# Altium schematic sheet Power1.SchDoc
size A3
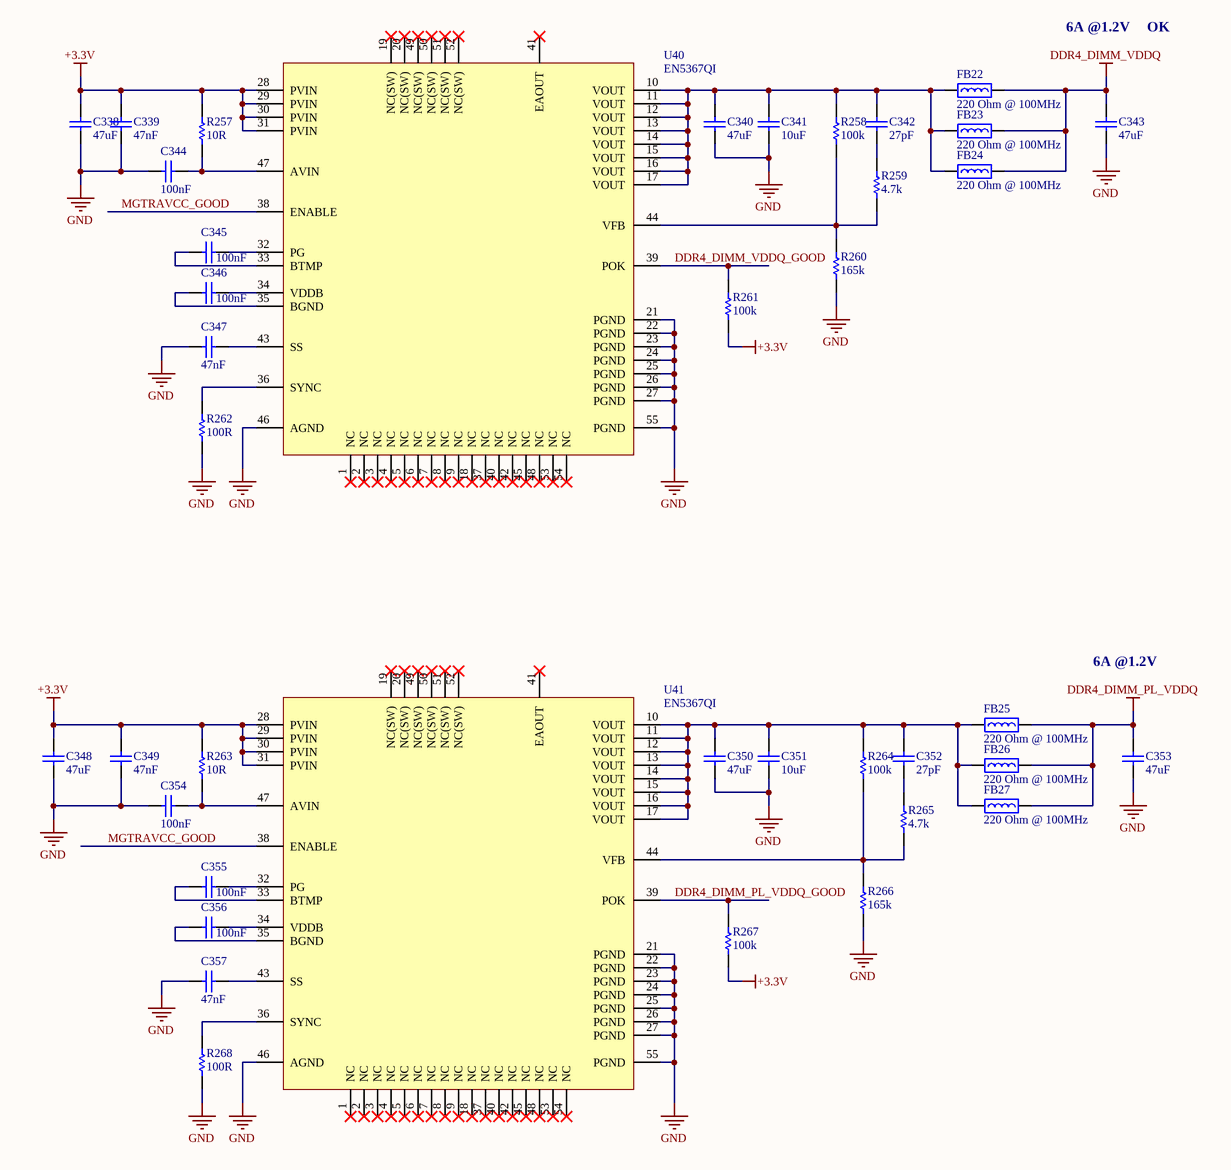
[diagram p0: Power1.SchDoc]

## Parts
C338  47uF  [CAPC3216L_1206]
C339  47nF  [CAPC2012L_0805]
C340  47uF  [CAPC3216L_1206]
C341  10uF  [CAPC1005L_0402]
C342  27pF  [CAPC1005L_0402]
C343  47uF  [CAPC3216L_1206]
C344  100nF  [CAPC1005L_0402]
C345  100nF  [CAPC1005L_0402]
C346  100nF  [CAPC1005L_0402]
C347  47nF  [CAPC2012L_0805]
C348  47uF  [CAPC3216L_1206]
C349  47nF  [CAPC2012L_0805]
C350  47uF  [CAPC3216L_1206]
C351  10uF  [CAPC1005L_0402]
C352  27pF  [CAPC1005L_0402]
C353  47uF  [CAPC3216L_1206]
C354  100nF  [CAPC1005L_0402]
C355  100nF  [CAPC1005L_0402]
C356  100nF  [CAPC1005L_0402]
C357  47nF  [CAPC2012L_0805]
FB22  Impedance @ Frequency: 220 Ohm @ 100MHz  [INDC1608N_0603]  (hidden comment: BEAD0603_220_2A5_40M)
FB23  Impedance @ Frequency: 220 Ohm @ 100MHz  [INDC1608N_0603]  (hidden comment: BEAD0603_220_2A5_40M)
FB24  Impedance @ Frequency: 220 Ohm @ 100MHz  [INDC1608N_0603]  (hidden comment: BEAD0603_220_2A5_40M)
FB25  Impedance @ Frequency: 220 Ohm @ 100MHz  [INDC1608N_0603]  (hidden comment: BEAD0603_220_2A5_40M)
FB26  Impedance @ Frequency: 220 Ohm @ 100MHz  [INDC1608N_0603]  (hidden comment: BEAD0603_220_2A5_40M)
FB27  Impedance @ Frequency: 220 Ohm @ 100MHz  [INDC1608N_0603]  (hidden comment: BEAD0603_220_2A5_40M)
R257  value 10R  [RESC1005L_0402]  (hidden comment: RES0402_10R_0W1_1T)
R258  value 100k  [RESC1005L_0402]  (hidden comment: RES0402_100K_0W2_1T)
R259  value 4.7k  [RESC1005L_0402]  (hidden comment: RES0402_4K7_0W1_1T)
R260  value 165k  [RESC1005L_0402]  (hidden comment: RES0402_165K_0W1_1T)
R261  value 100k  [RESC1005L_0402]  (hidden comment: RES0402_100K_0W2_1T)
R262  value 100R  [RESC1005L_0402]  (hidden comment: RES0402_100R_0W1_1T)
R263  value 10R  [RESC1005L_0402]  (hidden comment: RES0402_10R_0W1_1T)
R264  value 100k  [RESC1005L_0402]  (hidden comment: RES0402_100K_0W2_1T)
R265  value 4.7k  [RESC1005L_0402]  (hidden comment: RES0402_4K7_0W1_1T)
R266  value 165k  [RESC1005L_0402]  (hidden comment: RES0402_165K_0W1_1T)
R267  value 100k  [RESC1005L_0402]  (hidden comment: RES0402_100K_0W2_1T)
R268  value 100R  [RESC1005L_0402]  (hidden comment: RES0402_100R_0W1_1T)
U40  EN5367QI  [QFN54-EN5367QI]
U41  EN5367QI  [QFN54-EN5367QI]

## Nets
+3.3V: C338.2 C339.2 C348.2 C349.2 R257.2 R261.2 R263.2 R267.2 U40.28(PVIN) U40.29(PVIN) U40.30(PVIN) U40.31(PVIN) U41.28(PVIN) U41.29(PVIN) U41.30(PVIN) U41.31(PVIN)
DDR4_DIMM_PL_VDDQ: C353.2 FB25.2 FB26.2 FB27.2
DDR4_DIMM_VDDQ: C343.2 FB22.2 FB23.2 FB24.2
GND: C338.1 C339.1 C340.1 C341.1 C343.1 C344.2 C347.2 C348.1 C349.1 C350.1 C351.1 C353.1 C354.2 C357.2 R260.1 R262.2 R266.1 R268.2 U40.21(PGND) U40.22(PGND) U40.23(PGND) U40.24(PGND) U40.25(PGND) U40.26(PGND) U40.27(PGND) U40.46(AGND) U40.55(PGND) U41.21(PGND) U41.22(PGND) U41.23(PGND) U41.24(PGND) U41.25(PGND) U41.26(PGND) U41.27(PGND) U41.46(AGND) U41.55(PGND)
DDR4_DIMM_PL_VDDQ_GOOD: R267.1 U41.39(POK)
DDR4_DIMM_VDDQ_GOOD: R261.1 U40.39(POK)
MGTRAVCC_GOOD: U40.38(ENABLE) U41.38(ENABLE)
NetC340_2: C340.2 C341.2 C342.2 FB22.1 FB23.1 FB24.1 R258.2 U40.10(VOUT) U40.11(VOUT) U40.12(VOUT) U40.13(VOUT) U40.14(VOUT) U40.15(VOUT) U40.16(VOUT) U40.17(VOUT)
NetC342_1: C342.1 R259.2
NetC344_1: C344.1 R257.1 U40.47(AVIN)
NetC345_1: C345.1 U40.32(PG)
NetC345_2: C345.2 U40.33(BTMP)
NetC346_1: C346.1 U40.34(VDDB)
NetC346_2: C346.2 U40.35(BGND)
NetC347_1: C347.1 U40.43(SS)
NetC350_2: C350.2 C351.2 C352.2 FB25.1 FB26.1 FB27.1 R264.2 U41.10(VOUT) U41.11(VOUT) U41.12(VOUT) U41.13(VOUT) U41.14(VOUT) U41.15(VOUT) U41.16(VOUT) U41.17(VOUT)
NetC352_1: C352.1 R265.2
NetC354_1: C354.1 R263.1 U41.47(AVIN)
NetC355_1: C355.1 U41.32(PG)
NetC355_2: C355.2 U41.33(BTMP)
NetC356_1: C356.1 U41.34(VDDB)
NetC356_2: C356.2 U41.35(BGND)
NetC357_1: C357.1 U41.43(SS)
NetR258_1: R258.1 R259.1 R260.2 U40.44(VFB)
NetR262_1: R262.1 U40.36(SYNC)
NetR264_1: R264.1 R265.1 R266.2 U41.44(VFB)
NetR268_1: R268.1 U41.36(SYNC)

Not connected (* = marked no-connect by the designer): U40 1(NC)* 2(NC)* 3(NC)* 4(NC)* 5(NC)* 6(NC)* 7(NC)* 8(NC)* 9(NC)* 18(NC)* 19(NC(SW))* 20(NC(SW))* 37(NC)* 40(NC)* 41(EAOUT)* 42(NC)* 45(NC)* 48(NC)* 49(NC(SW))* 50(NC(SW))* 51(NC(SW))* 52(NC(SW))* 53(NC)* 54(NC)*; U41 1(NC)* 2(NC)* 3(NC)* 4(NC)* 5(NC)* 6(NC)* 7(NC)* 8(NC)* 9(NC)* 18(NC)* 19(NC(SW))* 20(NC(SW))* 37(NC)* 40(NC)* 41(EAOUT)* 42(NC)* 45(NC)* 48(NC)* 49(NC(SW))* 50(NC(SW))* 51(NC(SW))* 52(NC(SW))* 53(NC)* 54(NC)*

## Notes on the sheet
- 6A @1.2V
- OK

## Library data of the parts
C338 C340 C343 C348 C350 C353 = CAPCER1206X5R47U25V_20T: CAP CER 47UF 25V X5R 1206; Manufacturer 1: TDK Corporation; Manufacturer Part Number 1: C3216X5R1E476M160AC; Tolerance: 20%; Package: 1206; ComponentLink1Description: Datasheet; Value: 47uF; Voltage: 25V; Temperature Coefficient: X5R; Supplier 1: Digi-Key; Supplier Part Number 1: 445-8047-1-ND; Operating Temperature: -55°C ~ 85°C
C339 C347 C349 C357 = CAPCER0805X5R47N50V_10T: CAP CER 0.047UF 50V X7R 0805; Manufacturer 1: Kemet; Manufacturer Part Number 1: C0805C473K5RACTU; Tolerance: 10%; Package: 0805; ComponentLink1Description: Datasheet; Value: 47nF; Voltage: 50V; Temperature Coefficient: X7R; Supplier 1: Digi-Key; Supplier Part Number 1: 399-1166-1-ND; Operating Temperature: -55°C ~ 125°C
C341 C351 = CAPCER0402X5R10U10V_20T: CAP CER 10UF 10V X5R 0402; Manufacturer 1: Samsung Electro-Mechanics America, Inc.; Manufacturer Part Number 1: CL05A106MP5NUNC; Tolerance: 20%; Package: 0402; ComponentLink1Description: Datasheet; Value: 10uF; Voltage: 10V; Temperature Coefficient: X5R; Supplier 1: Digi-Key; Supplier Part Number 1: 1276-1450-1-ND; Operating Temperature: -55°C ~ 85°C
C342 C352 = CAPCER0402C0G27P50V_5T: CAP CER 27PF 50V C0G/NP0 0402; Manufacturer 1: Murata Electronics North America; Manufacturer Part Number 1: GRM1555C1H270JA01D; Tolerance: 5%; Package: 0402; ComponentLink1Description: Datasheet; Value: 27pF; Voltage: 50V; Temperature Coefficient: C0G/NP0; Supplier 1: Digi-Key; Supplier Part Number 1: 490-5869-1-ND; Operating Temperature: -55°C ~ 125°C
C344-C346 C354-C356 = CAPCER0402X7R100N25V_10T: CAP CER 0.1UF 25V X7R 0402; Manufacturer 1: Murata Electronics North America; Manufacturer Part Number 1: GRM155R71E104KE14D; Tolerance: 10%; Package: 0402; ComponentLink1Description: Datasheet; Value: 100nF; Voltage: 25V; Temperature Coefficient: X7R; Supplier 1: Digi-Key; Supplier Part Number 1: 490-10698-1-ND; Operating Temperature: -55°C ~ 125°C
FB22-FB27 = BEAD0603_220_2A5_40M: FERRITE BEAD 220 OHM 0603 1LN; Manufacturer 1: Murata Electronics North America; Manufacturer Part Number 1: BLM18SG221TN1D; Current Rating (Max): 2.5A; DC Resistance (DCR) (Max): 40 mohm; Package: 0603; ComponentLink1Description: Datasheet; ComponentLink1URL: C:\Users\Public\Documents\Altium\AD16\Library\PDF\ENFA0003.pdf; Supplier 1: Digi-Key; Supplier Part Number 1: 490-5225-1-ND; Operating Temperature: -55°C ~ 125°C
R257 R263 = RES0402_10R_0W1_1T: RES SMD 10 OHM 1% 1/10W 0402; Manufacturer 1: Panasonic Electronic Components; Manufacturer Part Number 1: ERJ-2RKF10R0X; Package: 0402; ComponentLink1Description: Datasheet; Power: 1/10W; Tolerance: 1%; Supplier 1: Digi-Key; Supplier Part Number 1: P10.0LCT-ND
R258 R261 R264 R267 = RES0402_100K_0W2_1T: RES SMD 100K OHM 1% 1/5W 0402; Manufacturer 1: Vishay Dale; Manufacturer Part Number 1: RCS0402100KFKED; Package: 0402; ComponentLink1Description: Datasheet; Power: 1/5W; Tolerance: 1%; Supplier 1: Digi-Key; Supplier Part Number 1: 541-2899-1-ND
R259 R265 = RES0402_4K7_0W1_1T: RES SMD 4.7K OHM 1% 1/10W 0402; Manufacturer 1: Panasonic Electronic Components; Manufacturer Part Number 1: ERJ-2RKF4701X; Package: 0402; ComponentLink1Description: Datasheet; Power: 1/10W; Tolerance: 1%; Supplier 1: Digi-Key; Supplier Part Number 1: P4.70KLCT-ND
R260 R266 = RES0402_165K_0W1_1T: RES SMD 165K OHM 1% 1/10W 0402; Manufacturer 1: Panasonic Electronic Components; Manufacturer Part Number 1: ERJ-2RKF1653X; Package: 0402; ComponentLink1Description: Datasheet; Power: 1/10W; Tolerance: ±1%; Supplier 1: Digikey; Supplier Part Number 1: P165KLCT-ND
R262 R268 = RES0402_100R_0W1_1T: RES SMD 100 OHM 1% 1/10W 0402; Manufacturer 1: Panasonic Electronic Components; Manufacturer Part Number 1: ERJ-2RKF1000X; Package: 0402; ComponentLink1Description: Datasheet; Power: 1/10W; Tolerance: 1%; Supplier 1: Digi-Key; Supplier Part Number 1: P100LCT-ND
U40 U41 = EN5367QI: DC/DC CONVERTER 0.6-4.9V 29W; Manufacturer 1: Altera; Voltage - Output: 0.6 ~ 4.9 V; Voltage - Input: 2.5V - 5.5V; ComponentLink1Description: Datasheet; ComponentLink1URL: C:\Users\Public\Documents\Altium\AD16\Library\PDF\en5367qi_07013.pdf; Supplier 1: Digi-Key; Supplier Part Number 1: 544-2858-1-ND; Manufacturer Part Number 1: EN5367QI; Operating Temperature: -40°C ~ 85°C